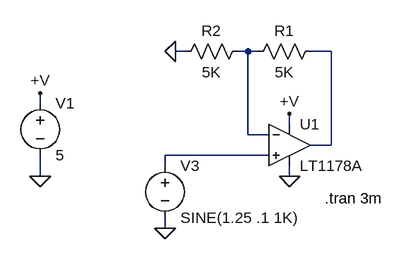
[diagram p0: schematic 1178A.asc]
1178A.asc, the LTspice schematic file:
Version 4
SHEET 1 896 680
WIRE 32 96 16 96
WIRE 128 96 112 96
WIRE 144 96 128 96
WIRE 256 96 224 96
WIRE -192 176 -192 160
WIRE 192 208 192 192
WIRE 128 224 128 96
WIRE 160 224 128 224
WIRE 256 240 256 96
WIRE 256 240 224 240
WIRE 160 256 0 256
WIRE 0 272 0 256
WIRE -192 288 -192 256
WIRE 192 288 192 272
WIRE 0 368 0 352
FLAG -192 288 0
FLAG 192 192 +V
FLAG -192 160 +V
FLAG 16 96 0
FLAG 0 368 0
FLAG 192 288 0
SYMBOL voltage -192 160 R0
SYMATTR InstName V1
SYMATTR Value 5
SYMBOL res 240 80 R90
WINDOW 0 0 56 VBottom 0
WINDOW 3 32 56 VTop 0
SYMATTR InstName R1
SYMATTR Value 5K
SYMBOL res 128 80 R90
WINDOW 0 0 56 VBottom 0
WINDOW 3 32 56 VTop 0
SYMATTR InstName R2
SYMATTR Value 5K
SYMBOL voltage 0 256 R0
SYMATTR InstName V3
SYMATTR Value SINE(1.25 .1 1K)
SYMBOL opamps\\LT1178A 192 176 R0
SYMATTR InstName U1
TEXT 246 322 Left 0 !.tran 3m

The netlist it stands for:
* 1178A.asc
V1 +V 0 5
R1 N002 N001 5K
R2 N001 0 5K
V3 N003 0 SINE(1.25 .1 1K)
XU1 N003 N001 +V 0 N002 LT1178A  ; pins In+ In- V+ V- OUT
.tran 3m
.backanno
.end